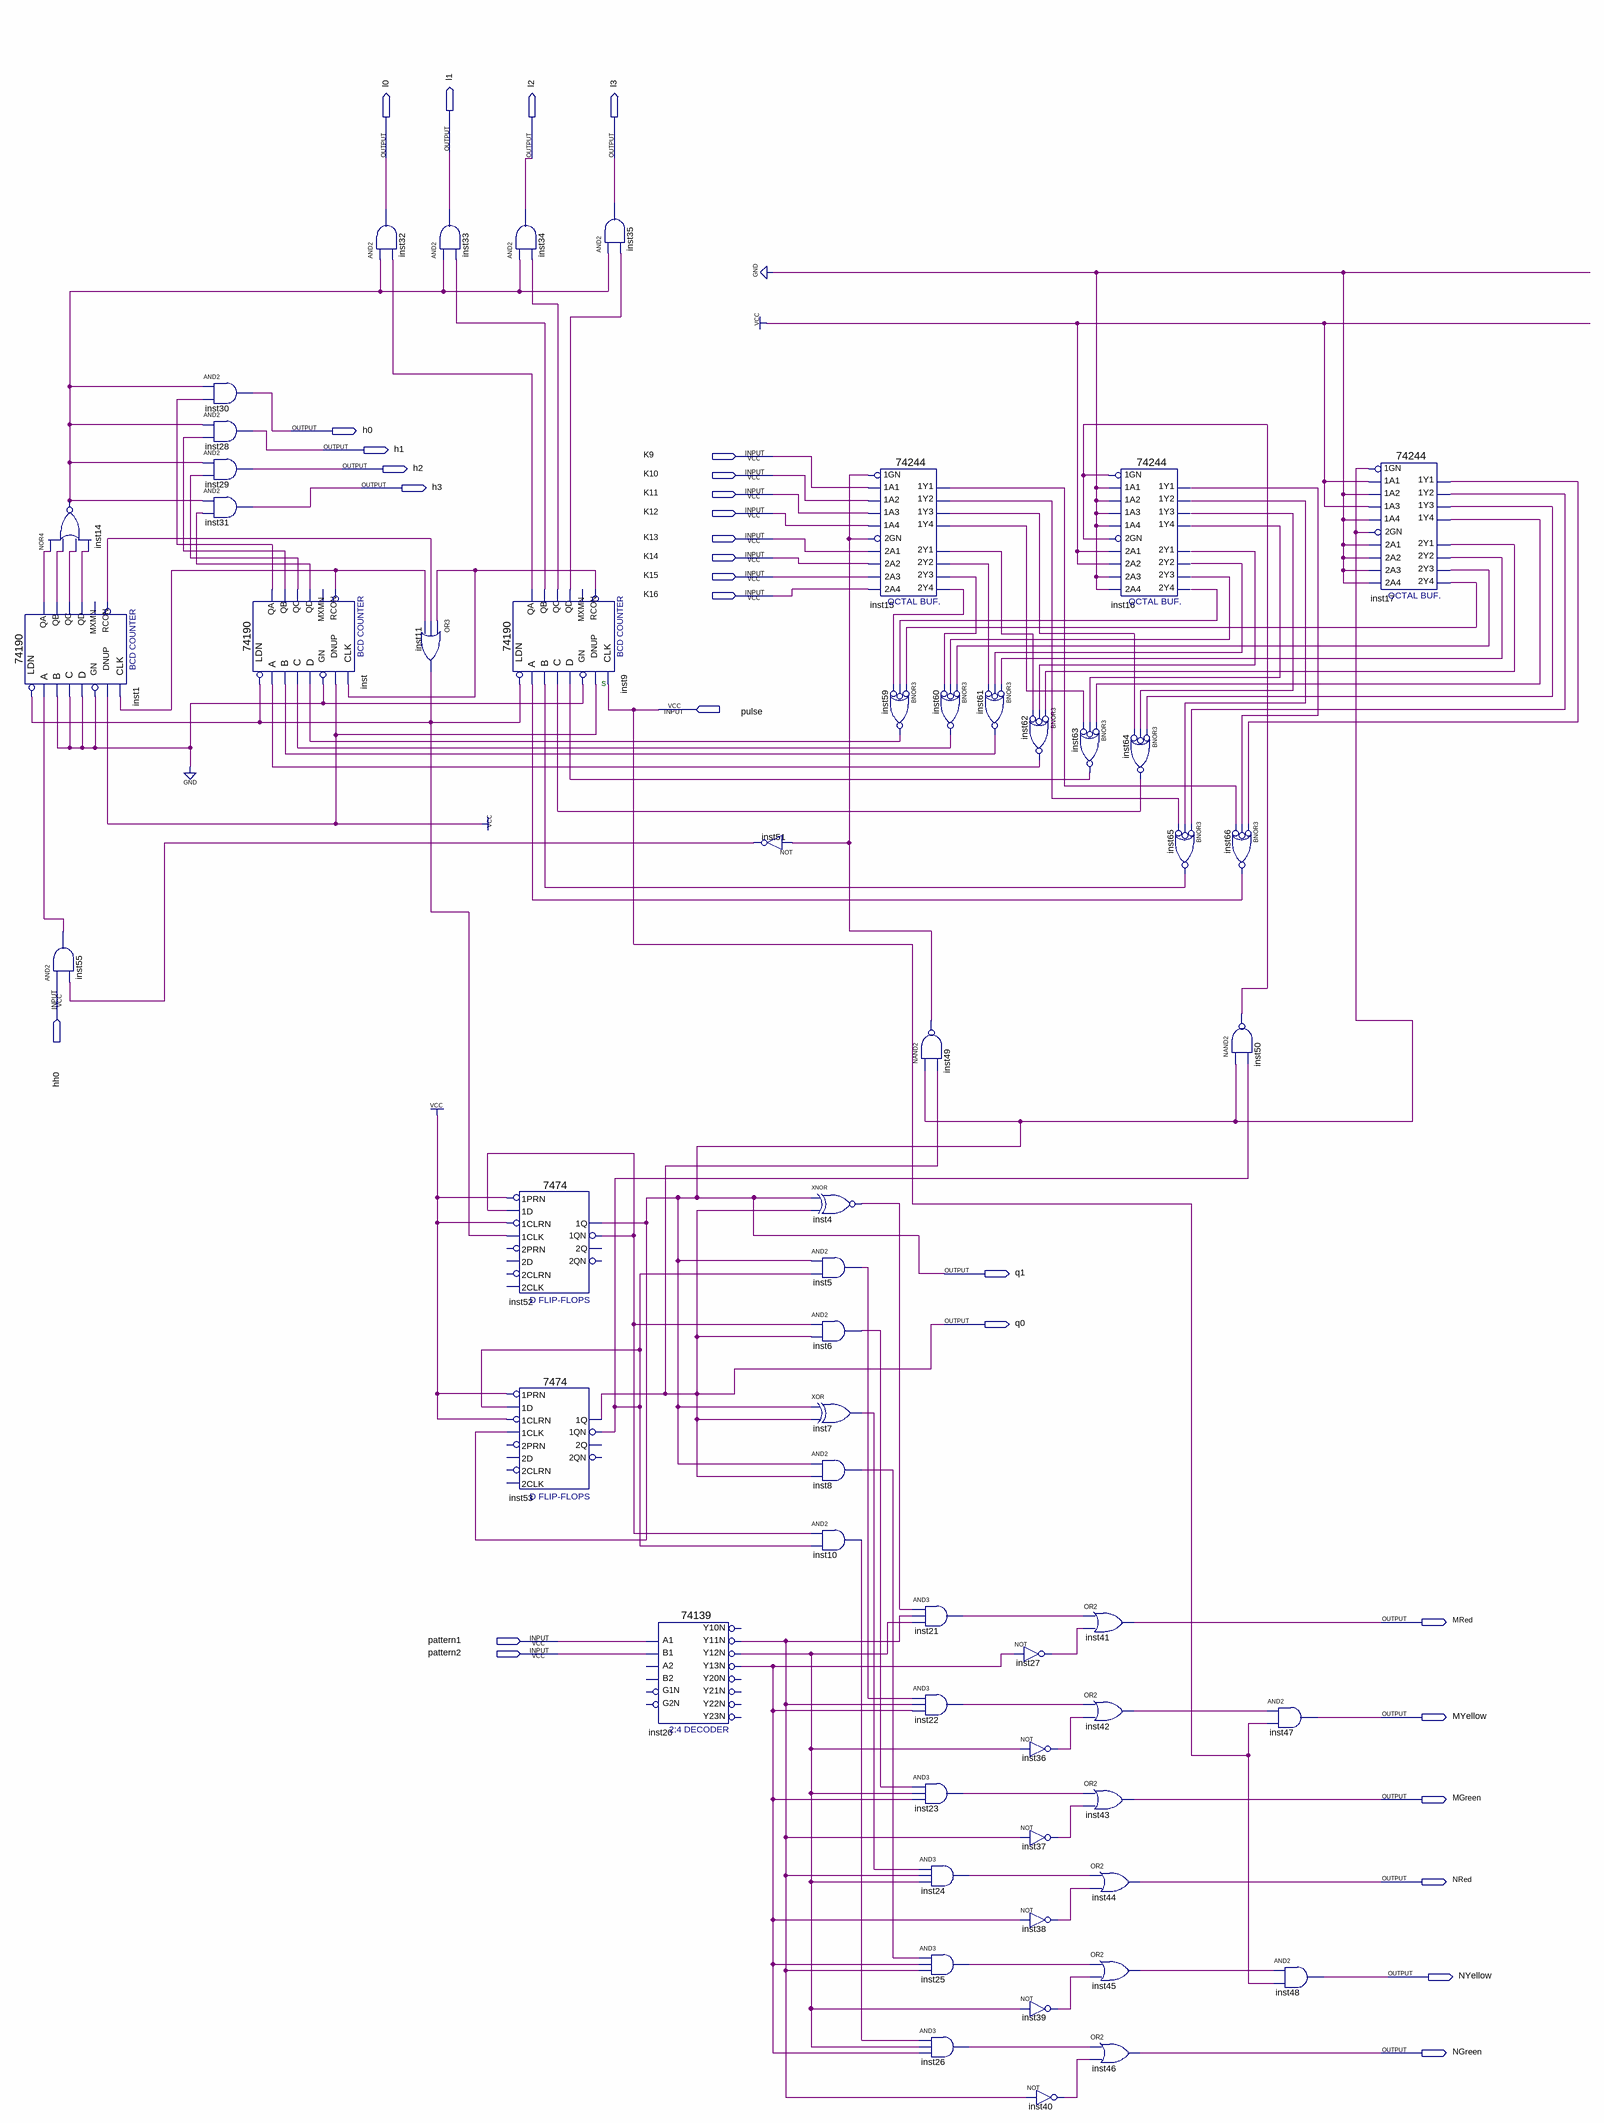
[diagram p0: schematic sheet]
// Quartus schematic 12.bdf as structural Verilog: 57 symbols, 28 pins
module \12  (
  input  K9,
  input  K10,
  input  K11,
  input  K12,
  input  K13,
  input  K14,
  input  K15,
  input  K16,
  input  pulse,
  input  hh0,
  input  pattern1,
  input  pattern2,
  output l1,
  output l0,
  output l2,
  output l3,
  output h0,
  output h1,
  output h2,
  output h3,
  output q1,
  output q0,
  output MRed,
  output MYellow,
  output MGreen,
  output NRed,
  output NYellow,
  output NGreen
);

  wire inst1_qa, inst1_qb, inst1_qc, inst1_qd, inst1_rcon, inst4_out, inst5_out, inst6_out, inst7_out,
       inst8_out, inst9_qa, inst9_qb, inst9_qc, inst9_qd, inst9_rcon, inst10_out, inst11_out, inst14_out,
       inst15_1y1, inst15_1y2, inst15_1y3, inst15_1y4, inst15_2y1, inst15_2y2, inst15_2y3, inst15_2y4,
       inst16_1y1, inst16_1y2, inst16_1y3, inst16_1y4, inst16_2y1, inst16_2y2, inst16_2y3, inst16_2y4,
       inst17_1y1, inst17_1y2, inst17_1y3, inst17_1y4, inst17_2y1, inst17_2y2, inst17_2y3, inst17_2y4,
       inst20_y11n, inst20_y12n, inst20_y13n, inst21_out, inst22_out, inst23_out, inst24_out, inst25_out,
       inst26_out, inst27_out, inst36_out, inst37_out, inst38_out, inst39_out, inst40_out, inst42_out,
       inst45_out, inst49_out, inst50_out, inst51_out, inst52_1qn, inst53_1qn, inst55_out, inst59_out,
       inst60_out, inst61_out, inst62_out, inst63_out, inst64_out, inst65_out, inst66_out, inst_qa, inst_qb,
       inst_qc, inst_qd, inst_rcon;

  nor inst14 (inst14_out, inst1_qa, inst1_qb, inst1_qc, inst1_qd);
  \74190  inst1 (
    .LDN(inst11_out), .A(inst55_out), .C(1'b0), .B(1'b0), .D(1'b0), .GN(1'b0), .CLK(inst_rcon), .DNUP(1'b1),
    .QA(inst1_qa), .QB(inst1_qb), .QD(inst1_qd), .QC(inst1_qc), .RCON(inst1_rcon));  // open: MXMN
  and inst55 (inst55_out, hh0, inst51_out);
  and inst30 (h0, inst14_out, inst_qa);
  and inst28 (h1, inst14_out, inst_qb);
  and inst29 (h2, inst14_out, inst_qc);
  and inst31 (h3, inst14_out, inst_qd);
  \74190  inst (
    .LDN(inst11_out), .A(inst62_out), .C(inst60_out), .B(inst61_out), .D(inst59_out), .GN(1'b0),
    .CLK(inst9_rcon), .DNUP(1'b1), .QA(inst_qa), .QB(inst_qb), .QD(inst_qd), .QC(inst_qc), .RCON(inst_rcon));  // open: MXMN
  and inst32 (l0, inst14_out, inst9_qa);
  and inst33 (l1, inst14_out, inst9_qb);
  or inst11 (inst11_out, inst9_rcon, inst1_rcon, inst_rcon);
  \74190  inst9 (
    .LDN(inst11_out), .A(inst66_out), .C(inst64_out), .B(inst65_out), .D(inst63_out), .GN(1'b0), .CLK(pulse),
    .DNUP(1'b1), .QA(inst9_qa), .QB(inst9_qb), .QD(inst9_qd), .QC(inst9_qc), .RCON(inst9_rcon));  // open: MXMN
  and inst34 (l2, inst14_out, inst9_qc);
  \7474  inst52 (
    .\1CLK (inst11_out), .\1D (inst52_1qn), .\1PRN (1'b1), .\1CLRN (1'b1), .\1QN (inst52_1qn), .\1Q (q1));  // open: 2D, 2PRN, 2CLK, 2CLRN, 2Q, 2QN
  \7474  inst53 (
    .\1CLK (q1), .\1D (inst53_1qn), .\1PRN (1'b1), .\1CLRN (1'b1), .\1QN (inst53_1qn), .\1Q (q0));  // open: 2D, 2PRN, 2CLK, 2CLRN, 2Q, 2QN
  and inst35 (l3, inst14_out, inst9_qd);
  \74139  inst20 (
    .A1(pattern1), .B1(pattern2), .Y13N(inst20_y13n), .Y12N(inst20_y12n), .Y11N(inst20_y11n));  // open: A2, B2, G1N, G2N, Y10N, Y20N, Y21N, Y22N, Y23N
  not inst51 (inst51_out, inst49_out);
  xnor inst4 (inst4_out, q1, q0);
  and inst5 (inst5_out, q1, inst53_1qn);
  and inst6 (inst6_out, inst52_1qn, q0);
  xor inst7 (inst7_out, q1, q0);
  and inst8 (inst8_out, q1, q0);
  and inst10 (inst10_out, inst52_1qn, inst53_1qn);
  \74244  inst15 (
    .\1A2 (K10), .\1A4 (K12), .\1A1 (K9), .\1A3 (K11), .\1GN (inst49_out), .\2A3 (K15), .\2GN (inst49_out),
    .\2A1 (K13), .\2A4 (K16), .\2A2 (K14), .\1Y2 (inst15_1y2), .\1Y4 (inst15_1y4), .\2Y1 (inst15_2y1),
    .\1Y1 (inst15_1y1), .\2Y3 (inst15_2y3), .\2Y4 (inst15_2y4), .\1Y3 (inst15_1y3), .\2Y2 (inst15_2y2));
  nor inst59 (inst59_out, ~inst17_2y4, ~inst16_2y4, ~inst15_2y4);  // BNOR3
  nor inst60 (inst60_out, ~inst17_2y3, ~inst16_2y3, ~inst15_2y3);  // BNOR3
  nand inst49 (inst49_out, q1, q0);
  and inst21 (inst21_out, inst4_out, inst20_y11n, inst20_y12n);
  and inst22 (inst22_out, inst5_out, inst20_y11n, inst20_y13n);
  and inst23 (inst23_out, inst6_out, inst20_y12n, inst20_y13n);
  and inst24 (inst24_out, inst7_out, inst20_y11n, inst20_y12n);
  and inst25 (inst25_out, inst8_out, inst20_y13n, inst20_y11n);
  and inst26 (inst26_out, inst10_out, inst20_y12n, inst20_y13n);
  nor inst61 (inst61_out, ~inst17_2y2, ~inst16_2y2, ~inst15_2y2);  // BNOR3
  nor inst62 (inst62_out, ~inst17_2y1, ~inst16_2y1, ~inst15_2y1);  // BNOR3
  not inst27 (inst27_out, inst20_y13n);
  not inst36 (inst36_out, inst20_y12n);
  not inst37 (inst37_out, inst20_y11n);
  not inst38 (inst38_out, inst20_y13n);
  not inst39 (inst39_out, inst20_y12n);
  not inst40 (inst40_out, inst20_y11n);
  \74244  inst16 (
    .\1A2 (1'b0), .\1A4 (1'b0), .\1A1 (1'b0), .\1A3 (1'b0), .\1GN (inst50_out), .\2A3 (1'b0),
    .\2GN (inst50_out), .\2A1 (1'b1), .\2A4 (1'b0), .\2A2 (1'b1), .\1Y2 (inst16_1y2), .\1Y4 (inst16_1y4),
    .\2Y1 (inst16_2y1), .\1Y1 (inst16_1y1), .\2Y3 (inst16_2y3), .\2Y4 (inst16_2y4), .\1Y3 (inst16_1y3),
    .\2Y2 (inst16_2y2));
  nor inst63 (inst63_out, ~inst17_1y4, ~inst16_1y4, ~inst15_1y4);  // BNOR3
  or inst41 (MRed, inst21_out, inst27_out);
  or inst42 (inst42_out, inst22_out, inst36_out);
  or inst43 (MGreen, inst23_out, inst37_out);
  or inst44 (NRed, inst24_out, inst38_out);
  or inst45 (inst45_out, inst25_out, inst39_out);
  or inst46 (NGreen, inst26_out, inst40_out);
  nor inst64 (inst64_out, ~inst17_1y3, ~inst16_1y3, ~inst15_1y3);  // BNOR3
  nor inst65 (inst65_out, ~inst17_1y2, ~inst16_1y2, ~inst15_1y2);  // BNOR3
  nor inst66 (inst66_out, ~inst17_1y1, ~inst16_1y1, ~inst15_1y1);  // BNOR3
  nand inst50 (inst50_out, q1, inst53_1qn);
  and inst47 (MYellow, inst42_out, pulse);
  and inst48 (NYellow, inst45_out, pulse);
  \74244  inst17 (
    .\1A2 (1'b0), .\1A4 (1'b0), .\1A1 (1'b1), .\1A3 (1'b1), .\1GN (q1), .\2A3 (1'b0), .\2GN (q1),
    .\2A1 (1'b0), .\2A4 (1'b0), .\2A2 (1'b0), .\1Y2 (inst17_1y2), .\1Y4 (inst17_1y4), .\2Y1 (inst17_2y1),
    .\1Y1 (inst17_1y1), .\2Y3 (inst17_2y3), .\2Y4 (inst17_2y4), .\1Y3 (inst17_1y3), .\2Y2 (inst17_2y2));

  // Notes on the sheet:
  //   s
endmodule
